# EAGLE design simple-board (EAGLE 7.2.0)
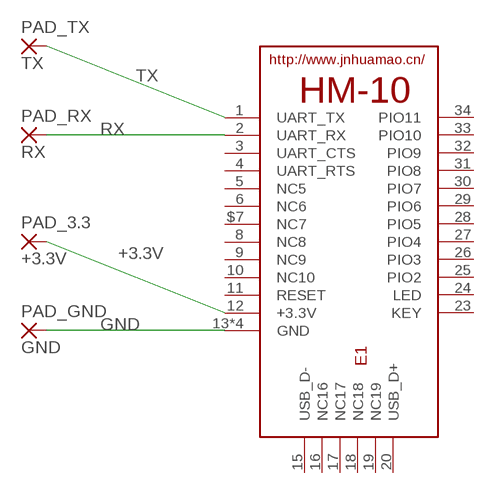
[diagram p0: schematic, sheet 1]

## Parts
E1  HM-10-BOARD  [26.9X13X2.2_BOARD]
PAD_3.3  +3.3V  1,6/0,8  [1,6/0,8]
PAD_GND  GND  1,6/0,8  [1,6/0,8]
PAD_RX  RX  1,6/0,8  [1,6/0,8]
PAD_TX  TX  1,6/0,8  [1,6/0,8]

## Nets
+3.3V: E1.12(+3.3V) PAD_3.3.1(P)
GND: E1.13(GND) E1.14(GND) E1.21(GND) E1.22(GND) PAD_GND.1(P)
RX: E1.2(UART_RX) PAD_RX.1(P)
TX: E1.1(UART_TX) PAD_TX.1(P)
Unconnected: E1.3(UART_CTS) E1.4(UART_RTS) E1.5(NC5) E1.6(NC6) E1.8(NC8) E1.9(NC9) E1.10(NC10) E1.11(RESET) E1.15(USB_D-) E1.16(NC16) E1.17(NC17) E1.18(NC18) E1.19(NC19) E1.20(USB_D+) E1.23(KEY) E1.24(LED) E1.25(PIO2) E1.26(PIO3) E1.27(PIO4) E1.28(PIO5) E1.29(PIO6) E1.30(PIO7) E1.31(PIO8) E1.32(PIO9) E1.33(PIO10) E1.34(PIO11) E1.$7(NC7)

## Library data of the parts
E1 = hm-10:HM-10: HM Bluetooth module use TI CC2540 or CC2541, Master and slave roles in one, transmission version and remote control version and PIO state acquisition functions in one, Support the AT command modify module parameters, Convenient and flexible.
PAD_3.3 PAD_GND PAD_RX PAD_TX = wirepad:1,6/0,8: THROUGH-HOLE PAD

## Net classes
0 default: clearance 0.205 mm

## Board
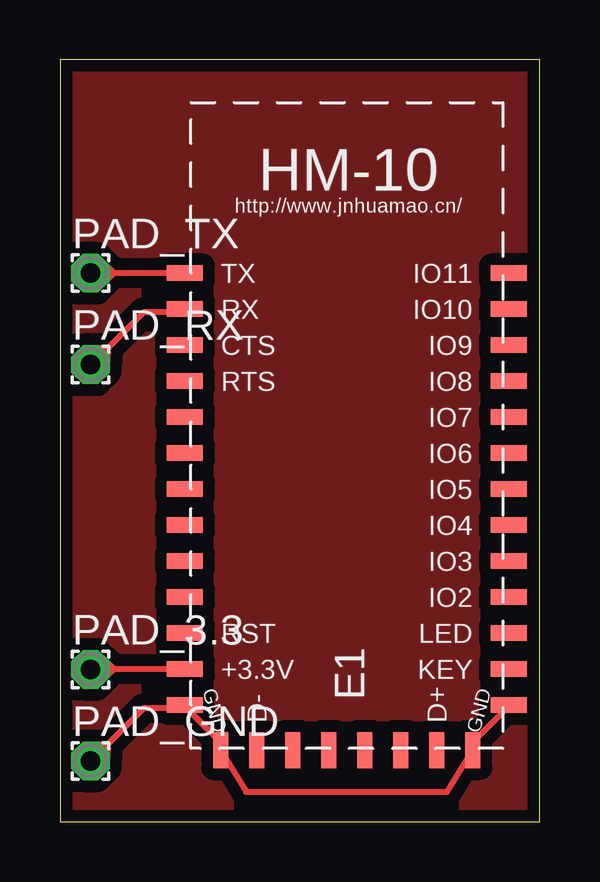
[diagram p1: board, top side]

Size 19.99 x 31.74 mm. Coordinates in mm from the lower left corner, seen from the top.
Outline: 0,0 19.99,0 19.99,31.74 0,31.74 0,0
Copper layers (1*16): Top 0.035mm / dielectric 1.5mm / Bottom 0.035mm
Design rules "default *": minimum track width 10mil, minimum drill 24mil, track to track 8mil, track to pad 8mil, pad to pad 8mil, via to via 8mil, smd to smd 8mil, copper to edge 0.5mm, drill to drill 8mil, minimum pad ring 10mil, minimum via ring 8mil, stop-mask expansion 4mil, vias tented up to drill 0mil, thermal gap 10mil

### Footprints (pad centres in the part's own frame; a part is rotated, then mirrored left to right if it is on the bottom)
26.9X13X2.2_BOARD = smd 1.5 x 0.635: 1 -7.5,0; 2 -7.5,-1.5; 3 -7.5,-3; 4 -7.5,-4.5; 5 -7.5,-6; 6 -7.5,-7.5; 8 -7.5,-10.5; 9 -7.5,-12; 10 -7.5,-13.5; 11 -7.5,-15; 12 -7.5,-16.5; 13 -7.5,-18; 22 6,-18; 23 6,-16.5; 24 6,-15; 25 6,-13.5; 26 6,-12; 27 6,-10.5; 28 6,-9; 29 6,-7.5; 30 6,-6; 31 6,-4.5; 32 6,-3; 33 6,-1.5; 34 6,0; $7 -7.5,-9 | smd 0.635 x 1.5: 14 -6,-19.875; 15 -4.5,-19.875; 16 -3,-19.875; 17 -1.5,-19.875; 18 0,-19.875; 19 1.5,-19.875; 20 3,-19.875; 21 4.5,-19.875
1,6/0,8 = drill 0.813 pad 1.6 octagon: 1 0,0

### Placement (x,y rotation side)
E1  12.7,22.86 0 top
PAD_3.3  1.27,6.35 0 top
PAD_GND  1.27,2.54 0 top
PAD_RX  1.27,19.05 0 top
PAD_TX  1.27,22.86 0 top

### Tracks (layer width: path | path; a pad name or v marks a point on that pad's centre or on a via)
+3.3V
  Top 0.254: E1.12 5.12,6.38 2.08,6.38 1.38,6.38 PAD_3.3.1
  Top 0.508: 2.08,6.38 1.62,6.77 PAD_3.3.1 1.65,5.96 2.08,6.38
GND
  Top 0.254: E1.22 18.62,4.75 17.25,3.38 17.25,3 E1.21 17.12,2.88 16.12,1.24 7.75,1.24 6.75,2.88 E1.14 6.62,3 6.62,3.38 5.25,4.75 E1.13 5.12,4.75 3.5,4.75 1.85,3.1 1.38,2.62 PAD_GND.1
  Top 0.508: 1.85,3.1 1.25,3.09 PAD_GND.1 1.81,2.5 1.85,3.1
N$1
  pour Top (isolate 0.5): 0,31.75 20.32,31.75 20.32,0 0,0
RX
  Top 0.254: E1.2 5.12,21.25 3.5,21.25 1.86,19.61 1.38,19.12 PAD_RX.1
  Top 0.508: 1.86,19.61 1.26,19.6 PAD_RX.1 1.81,19.01 1.86,19.61
TX
  Top 0.254: E1.1 5.12,22.88 2.08,22.88 1.38,22.88 PAD_TX.1
  Top 0.508: 2.08,22.88 1.63,23.27 PAD_TX.1 1.64,22.46 2.08,22.88